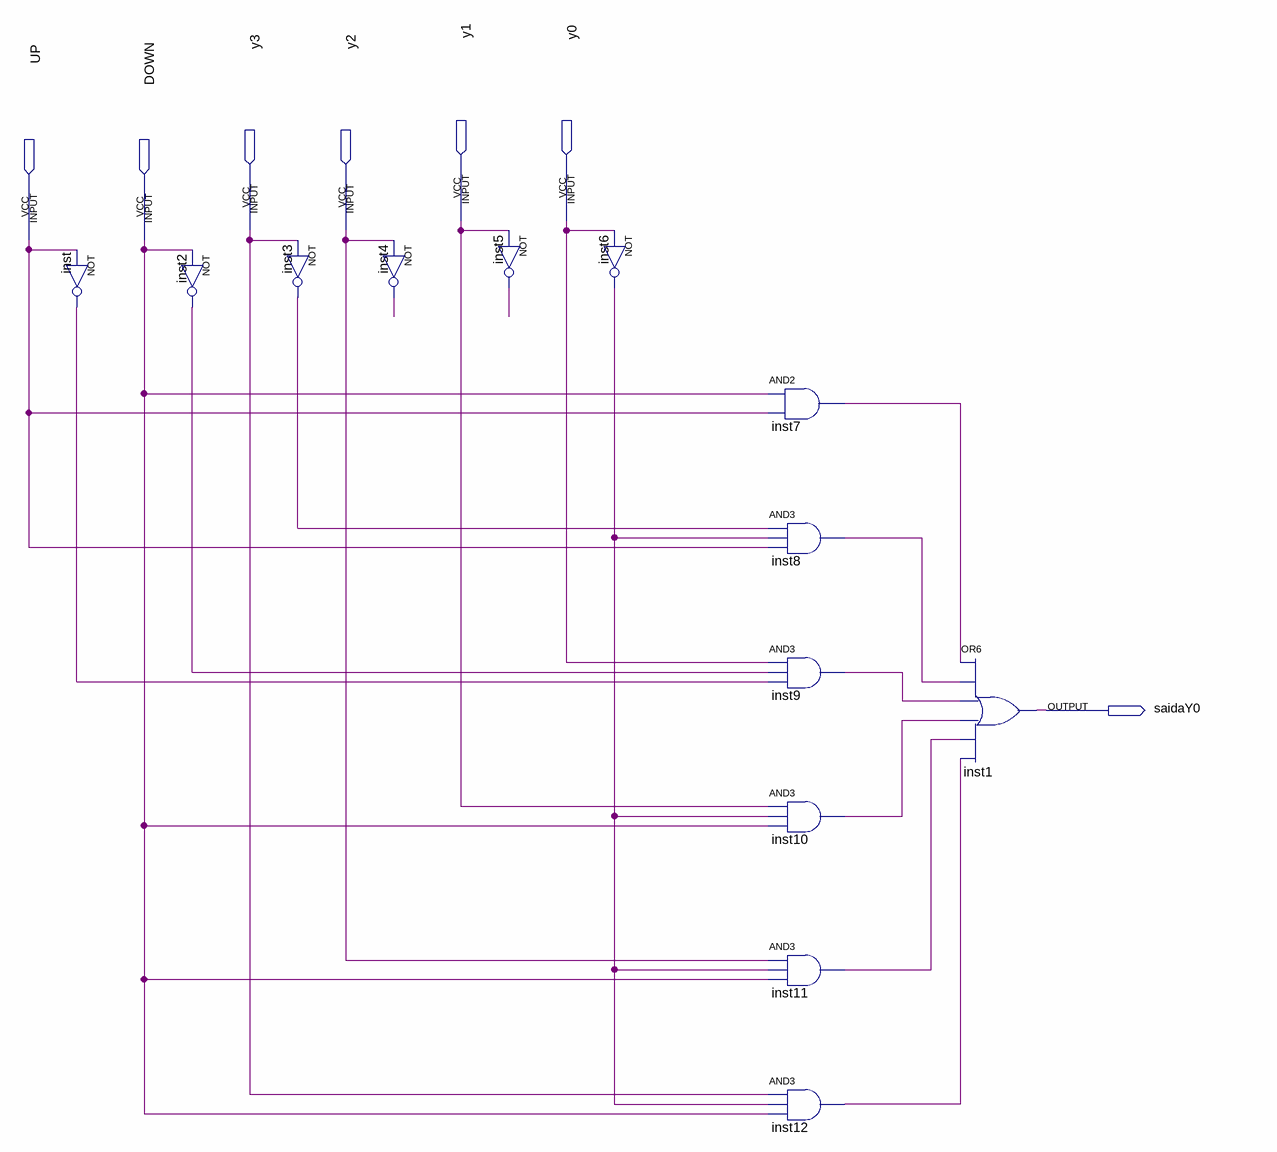
[diagram p0: schematic sheet]
// Quartus schematic Y0.bdf as structural Verilog: 13 symbols, 7 pins
module Y0 (
  input  y1,
  input  y0,
  input  y3,
  input  y2,
  input  UP,
  input  DOWN,
  output saidaY0
);

  wire inst2_out, inst3_out, inst4_out, inst5_out, inst6_out, inst7_out, inst8_out, inst9_out, inst10_out,
       inst11_out, inst12_out, inst_out;

  not inst (inst_out, UP);
  not inst2 (inst2_out, DOWN);
  not inst3 (inst3_out, y3);
  not inst4 (inst4_out, y2);
  not inst5 (inst5_out, y1);
  not inst6 (inst6_out, y0);
  and inst7 (inst7_out, DOWN, UP);
  and inst8 (inst8_out, inst3_out, inst6_out, UP);
  and inst9 (inst9_out, y0, inst2_out, inst_out);
  and inst10 (inst10_out, y1, inst6_out, DOWN);
  and inst11 (inst11_out, y2, inst6_out, DOWN);
  and inst12 (inst12_out, y3, inst6_out, DOWN);
  or inst1 (saidaY0, inst7_out, inst8_out, inst9_out, inst10_out, inst11_out, inst12_out);
endmodule
